# EAGLE design ELECTRICAL PCB SMART DISPENSER REVISI (EAGLE 9.6.2)
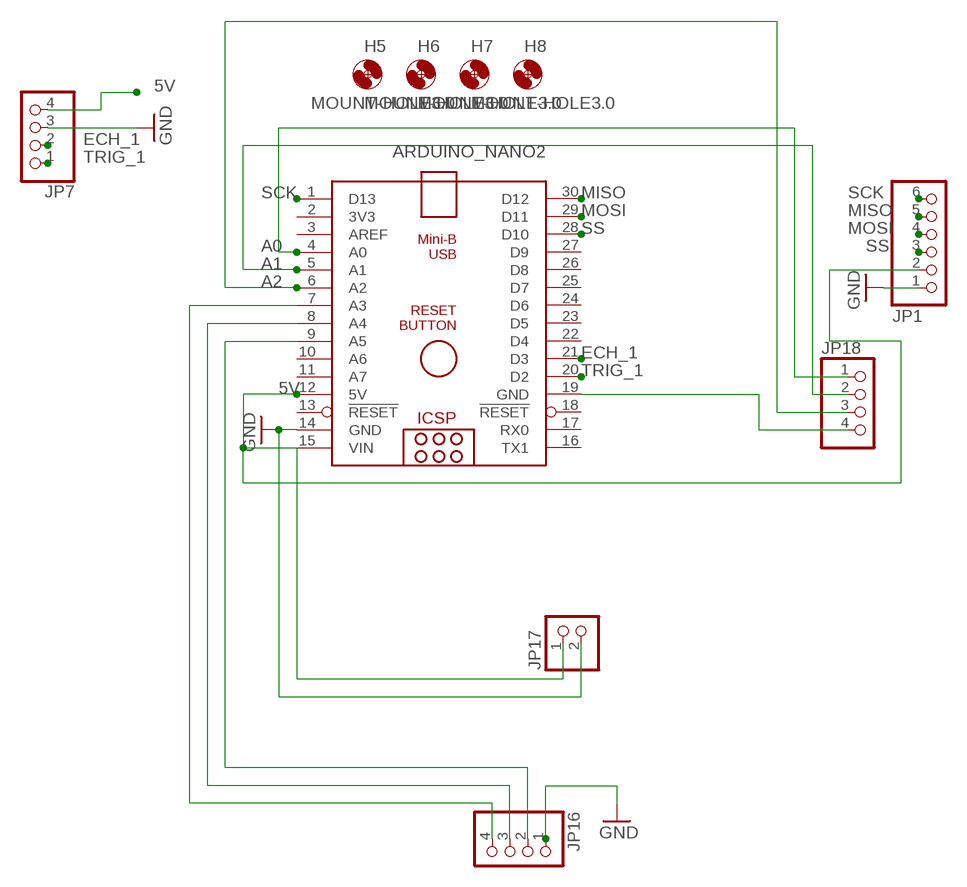
[diagram p0: schematic, sheet 1]

## Parts
ARDUINO_NANO2  ARDUINO_NANO  [ARDUINO_NANO]
H5  MOUNT-HOLE3.0  [3,0]
H6  MOUNT-HOLE3.0  [3,0]
H7  MOUNT-HOLE3.0  [3,0]
H8  MOUNT-HOLE3.0  [3,0]
JP1  PINHD-1X6  [1X06]
JP7  PINHD-1X4  [1X04]
JP16  PINHD-1X4  [1X04]
JP17  PINHD-1X2  [1X02]
JP18  PINHD-1X4  [1X04]

## Nets
5V: ARDUINO_NANO2.12(5V) ARDUINO_NANO2.15(VIN) JP1.2 JP7.4 JP17.1
A0: ARDUINO_NANO2.4(A0) JP18.1
A1: ARDUINO_NANO2.5(A1) JP18.2
A2: ARDUINO_NANO2.6(A2) JP18.3
A4: ARDUINO_NANO2.9(A5) JP16.2
A6: ARDUINO_NANO2.7(A3) JP16.4
ECH_1: ARDUINO_NANO2.21(D3) JP7.2
GND: ARDUINO_NANO2.14(GND) JP1.1 JP7.3 JP16.1 JP17.2
MISO: ARDUINO_NANO2.30(D12) JP1.5
MOSI: ARDUINO_NANO2.29(D11) JP1.4
N$5: ARDUINO_NANO2.8(A4) JP16.3
N$8: ARDUINO_NANO2.19(GND) JP18.4
SCK: ARDUINO_NANO2.1(D13) JP1.6
SS: ARDUINO_NANO2.28(D10) JP1.3
TRIG_1: ARDUINO_NANO2.20(D2) JP7.1
Unconnected: ARDUINO_NANO2.2(3V3) ARDUINO_NANO2.3(AREF) ARDUINO_NANO2.10(A6) ARDUINO_NANO2.11(A7) ARDUINO_NANO2.13(!RESET) ARDUINO_NANO2.16(TX1) ARDUINO_NANO2.17(RX0) ARDUINO_NANO2.18(!RESET) ARDUINO_NANO2.22(D4) ARDUINO_NANO2.23(D5) ARDUINO_NANO2.24(D6) ARDUINO_NANO2.25(D7) ARDUINO_NANO2.26(D8) ARDUINO_NANO2.27(D9)

## Library data of the parts
ARDUINO_NANO2 = ArduinoNanoV30:ARDUINO_NANO: Arduino Nano V3.0 Overview: The Arduino Nano is a small, complete, and breadboard-friendly board based on the ATmega328 (Arduino Nano 3.x) or ATmega168 (Arduino Nano 2.x). It has more or less the same functionality of the Arduino Duemilanove, but in a different package. It lacks only a DC power jack, and works with a Mini-B USB cable instead of a standard one. The Nano was designed and is being produced by Gravitech. Specifications: Microcontroller Atmel ATmega168 or ATmega328 Operating Voltage (logic level) 5 V Input Voltage (recommended) 7-12 V Input Voltage (limits) 6-20 V Digital I/O Pins 14 (of which 6 provide PWM output) Analog Input Pins 8 DC Current per I/O Pin 40 mA Flash Memory 16 KB (ATmega168) or 32 KB (ATmega328) of which 2 KB used by bootloader SRAM 1 KB (ATmega168) or 2 KB (ATmega328) EEPROM 512 bytes (ATmega168) or 1 KB (ATmega328) Clock Speed 16 MHz Dimensions 0.73" x 1.70" Length 45 mm Width 18 mm Weigth 5 g Power: The Arduino Nano can be powered via the Mini-B USB connection, 6-20V unregulated external power supply (pin 30), or 5V regulated external power supply (pin 27). The power source is automatically selected to the highest voltage source. Memory: The ATmega168 has 16 KB of flash memory for storing code (of which 2 KB is used for the bootloader); the ATmega328 has 32 KB, (also with 2 KB used for the bootloader). The ATmega168 has 1 KB of SRAM and 512 bytes of EEPROM (which can be read and written with the EEPROM library); the ATmega328 has 2 KB of SRAM and 1 KB of EEPROM. Input and Output: Each of the 14 digital pins on the Nano can be used as an input or output, using pinMode(), digitalWrite(), and digitalRead() functions. They operate at 5 volts. Each pin can provide or receive a maximum of 40 mA and has an internal pull-up resistor (disconnected by default) of 20-50 kOhms. In addition, some pins have specialized functions. Visit Arduino - ArduinoBoardNano <https://www.arduino.cc/en/Main/ArduinoBoardNano>
H5-H8 = holes:MOUNT-HOLE: MOUNTING HOLE with drill center marker
JP1 = pinhead:PINHD-1X6: PIN HEADER
JP7 JP16 JP18 = pinhead:PINHD-1X4: PIN HEADER
JP17 = pinhead:PINHD-1X2: PIN HEADER

## Board
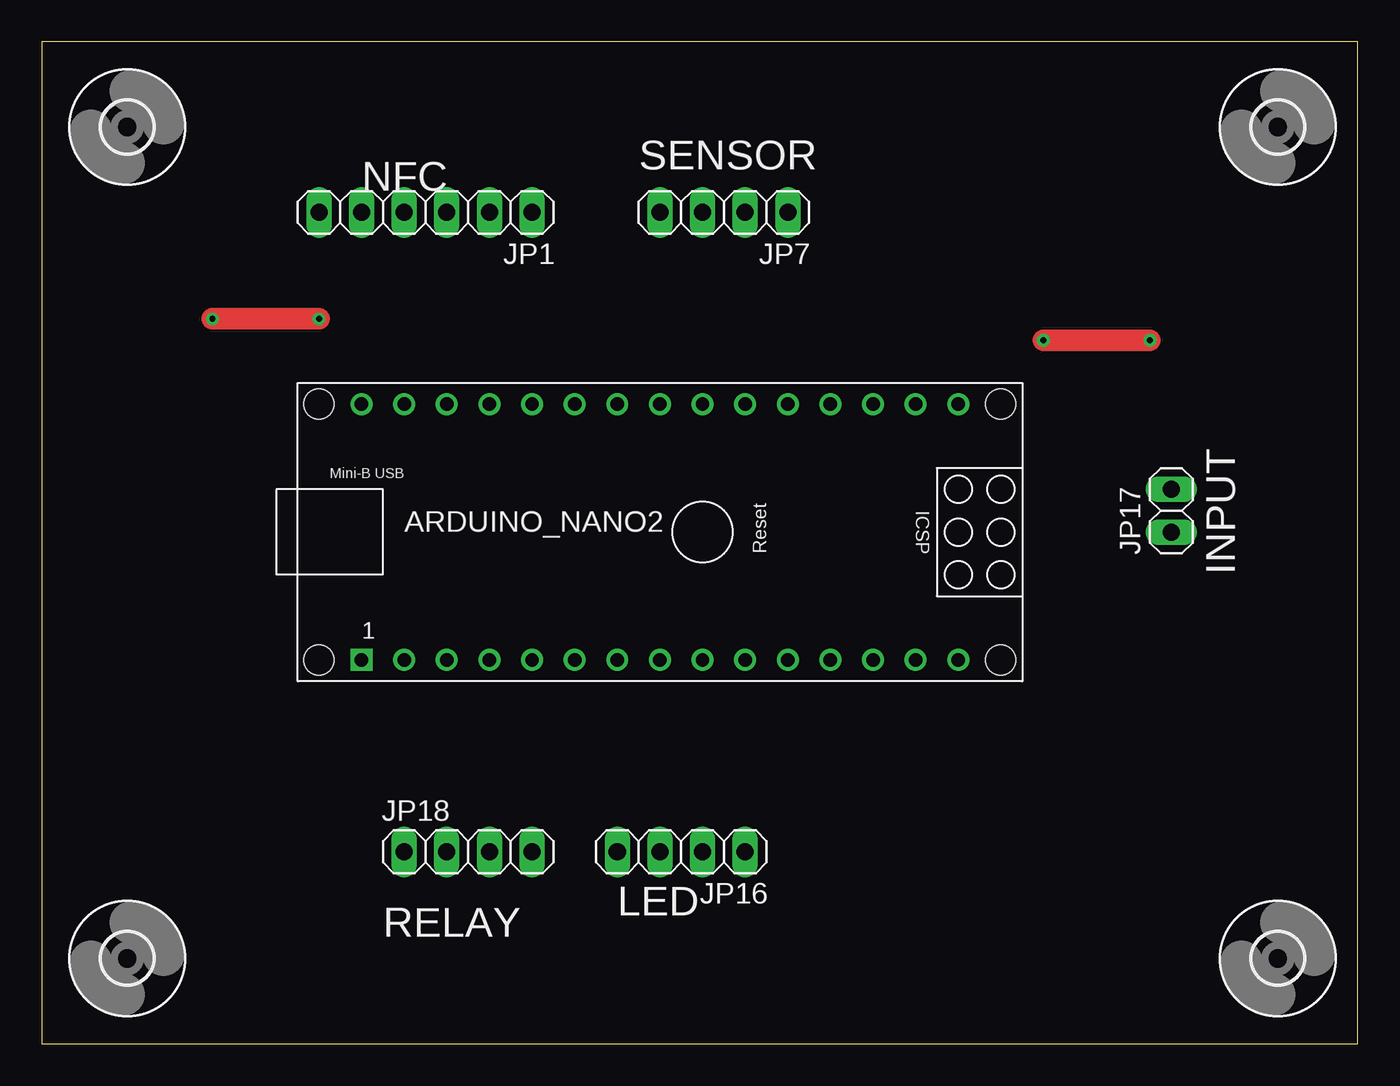
[diagram p1: board, top side]
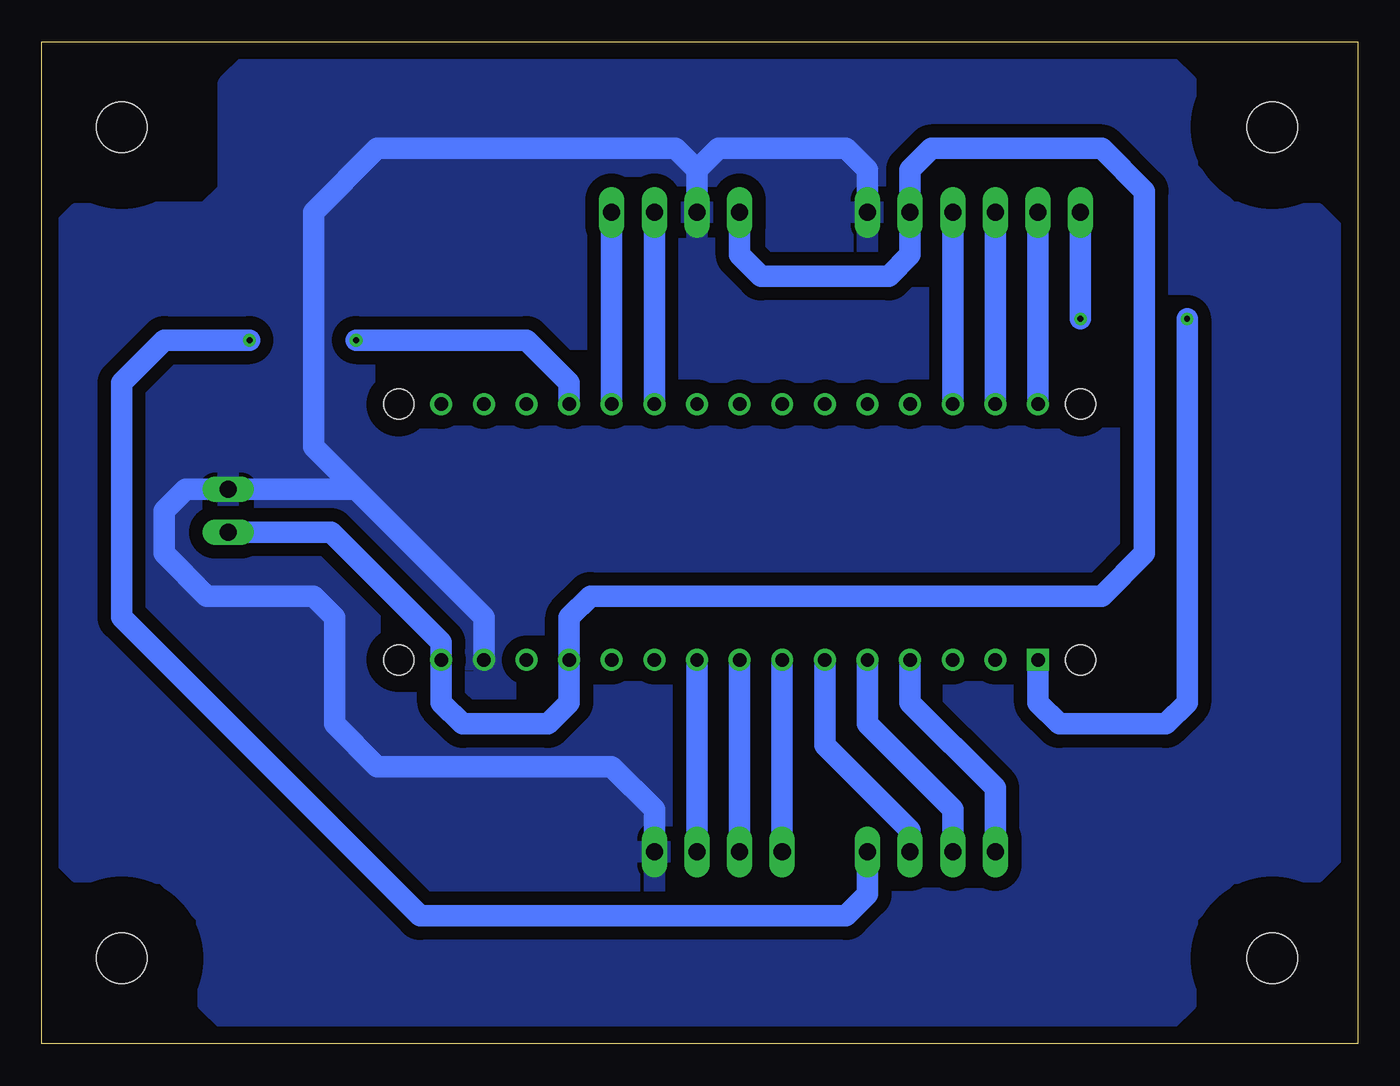
[diagram p2: board, bottom side, seen from below]

Size 78.41 x 59.68 mm. Coordinates in mm from the lower left corner, seen from the top.
Outline: 0,0 78.41,0 78.41,59.68 0,59.68 0,0
Copper layers (1*16): Top 0.035mm / dielectric 1.5mm / Bottom 0.035mm
Design rules "default": minimum track width 6mil, minimum drill 0.35mm, track to track 6mil, track to pad 6mil, pad to pad 6mil, via to via 6mil, smd to smd 6mil, copper to edge 40mil, drill to drill 6mil, minimum pad ring 10mil, minimum via ring 8mil, stop-mask expansion 4mil, vias tented up to drill 0mil, thermal gap 10mil

### Footprints (pad centres in the part's own frame; a part is rotated, then mirrored left to right if it is on the bottom)
ARDUINO_NANO = drill 0.8 square: 1 -20.32,-7.62 | drill 0.8: 2 -17.78,-7.62; 3 -15.24,-7.62; 4 -12.7,-7.62; 5 -10.16,-7.62; 6 -7.62,-7.62; 7 -5.08,-7.62; 8 -2.54,-7.62; 9 0,-7.62; 10 2.54,-7.62; 11 5.08,-7.62; 12 7.62,-7.62; 13 10.16,-7.62; 14 12.7,-7.62; 15 15.24,-7.62; 16 15.24,7.62; 17 12.7,7.62; 18 10.16,7.62; 19 7.62,7.62; 20 5.08,7.62; 21 2.54,7.62; 22 0,7.62; 23 -2.54,7.62; 24 -5.08,7.62; 25 -7.62,7.62; 26 -10.16,7.62; 27 -12.7,7.62; 28 -15.24,7.62; 29 -17.78,7.62; 30 -20.32,7.62 | hole 1.778: -22.86,-7.62; -22.86,7.62; 17.78,7.62; 17.78,-7.62
3,0 = hole 3: 0,0
1X06 = drill 1.016 long: 1 -6.35,0; 2 -3.81,0; 3 -1.27,0; 4 1.27,0; 5 3.81,0; 6 6.35,0
1X04 = drill 1.016 long: 1 -3.81,0; 2 -1.27,0; 3 1.27,0; 4 3.81,0
1X02 = drill 1.016 long: 1 -1.27,0; 2 1.27,0

### Placement (x,y rotation side)
ARDUINO_NANO2  39.37,30.48 0 top
H5  5.08,5.08 0 top
H6  73.66,5.08 0 top
H7  73.66,54.61 0 top
H8  5.08,54.61 0 top
JP1  22.86,49.53 180 top
JP7  40.64,49.53 180 top
JP16  38.1,11.43 180 top
JP17  67.31,31.75 90 top
JP18  25.4,11.43 0 top

### Tracks (layer width: path | path; a pad name or v marks a point on that pad's centre or on a via)
5V
  Bottom 1.27: JP17.1 61.18,30.48 54.61,23.91 ARDUINO_NANO2.15 54.61,20.32 53.34,19.05 48.26,19.05 46.99,20.32 ARDUINO_NANO2.12 46.99,25.4 45.72,26.67 15.24,26.67 12.7,29.21 12.7,50.8 15.24,53.34 25.4,53.34 26.67,52.07 JP1.2 26.67,46.99 27.94,45.72 35.56,45.72 36.83,46.99 JP7.4
A0
  Bottom 1.27: JP18.1 21.59,15.24 26.67,20.32 ARDUINO_NANO2.4
A1
  Bottom 1.27: JP18.2 24.13,13.97 29.21,19.05 ARDUINO_NANO2.5
A2
  Bottom 1.27: JP18.3 26.67,12.7 31.75,17.78 ARDUINO_NANO2.6
A4
  Bottom 1.27: JP16.2 ARDUINO_NANO2.9
A6
  Bottom 1.27: JP16.4 ARDUINO_NANO2.7
ECH_1
  Bottom 1.27: ARDUINO_NANO2.21 JP7.2
GND
  Bottom 1.27: ARDUINO_NANO2.14 52.07,25.4 59.69,33.02 | 39.37,52.07 40.64,53.34 58.42,53.34 62.23,49.53 62.23,35.56 59.69,33.02 | 39.37,52.07 JP7.3 | 59.69,33.02 JP17.2 69.85,33.02 71.12,31.75 71.12,29.21 68.58,26.67 62.23,26.67 60.96,25.4 60.96,19.05 58.42,16.51 44.45,16.51 41.91,13.97 JP16.1 | JP1.1 29.21,52.07 30.48,53.34 38.1,53.34 39.37,52.07
  pour Bottom (isolate 0.8): 13.97,58.42 66.04,58.42 67.31,57.15 67.31,50.8 68.58,49.53 74.93,49.53 76.2,49.53 77.47,48.26 77.47,46.99 77.47,11.43 76.2,10.16 71.12,10.16 69.85,8.89 68.58,7.62 68.58,3.81 68.58,2.54 67.31,1.27 12.7,1.27 11.43,1.27 10.16,2.54 10.16,7.62 8.89,8.89 7.62,10.16 3.81,10.16 2.54,10.16 1.27,11.43 1.27,12.7 1.27,48.26 2.54,49.53 7.62,49.53 10.16,52.07 10.16,57.15 11.43,58.42 12.7,58.42
MISO
  Bottom 1.27: JP1.5 ARDUINO_NANO2.30
MOSI
  Bottom 1.27: JP1.4 ARDUINO_NANO2.29
N$5
  Bottom 1.27: JP16.3 ARDUINO_NANO2.8
N$8  (via drill 0.35)
  Top 1.27: v66.04,41.91 v59.69,41.91
  Bottom 1.27: JP18.4 29.21,8.89 30.48,7.62 55.88,7.62 73.66,25.4 73.66,39.37 71.12,41.91 v66.04,41.91 | v59.69,41.91 49.53,41.91 46.99,39.37 ARDUINO_NANO2.19
SCK  (via drill 0.35)
  Top 1.27: v16.51,43.18 v10.16,43.18
  Bottom 1.27: JP1.6 v16.51,43.18 | v10.16,43.18 10.16,20.32 11.43,19.05 17.78,19.05 19.05,20.32 ARDUINO_NANO2.1
SS
  Bottom 1.27: JP1.3 ARDUINO_NANO2.28
TRIG_1
  Bottom 1.27: ARDUINO_NANO2.20 JP7.1

### Text on the board
tNames: SENSOR | NFC | INPUT | LED | RELAY